# Altium schematic sheet SChema 2.SchDoc
size A
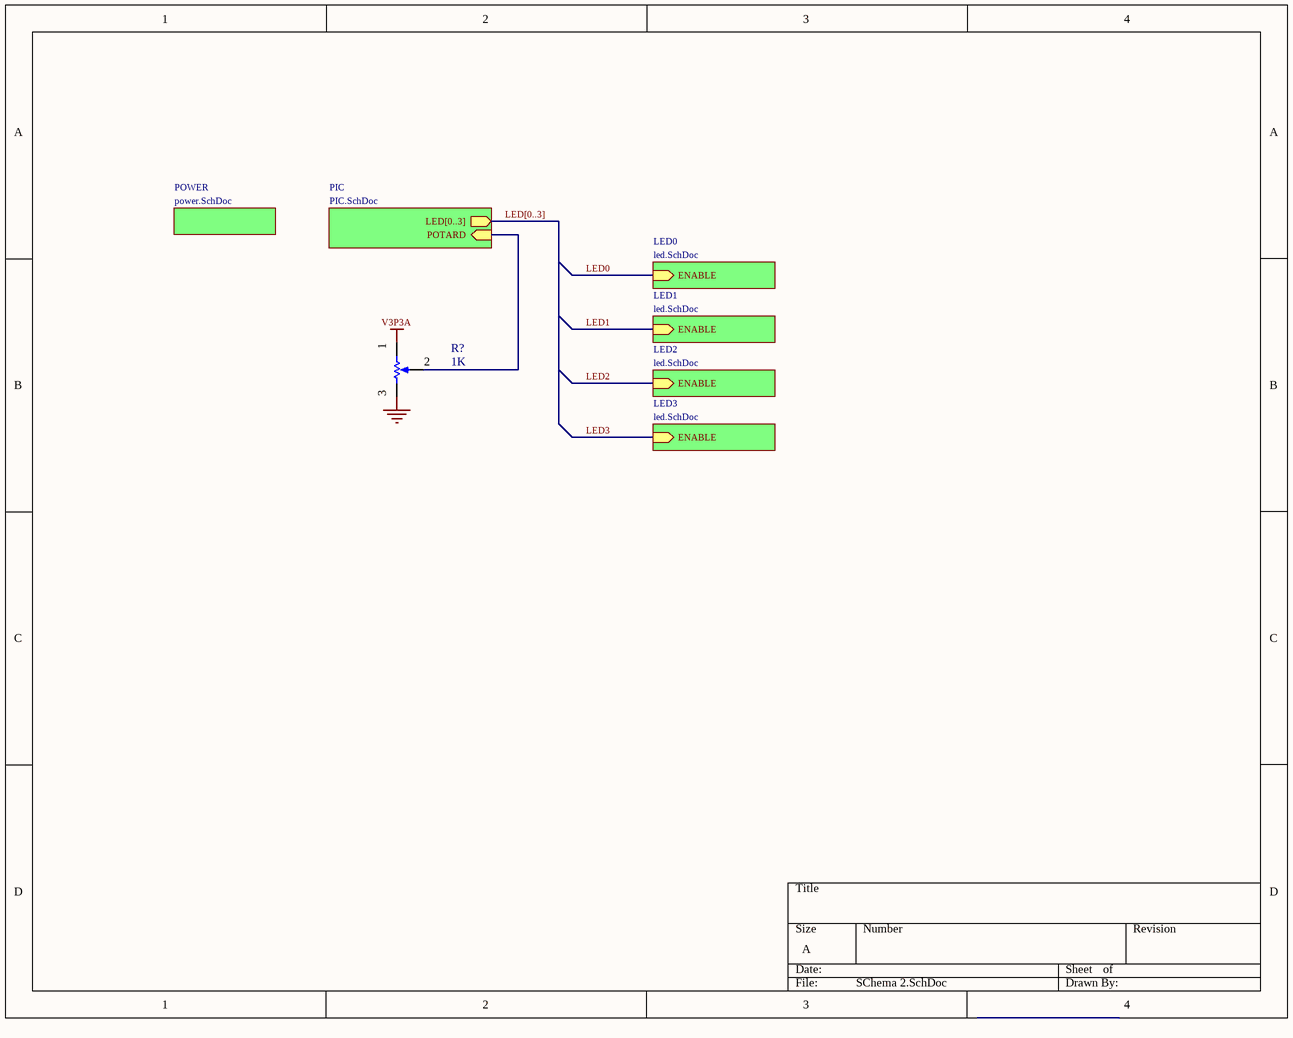
[diagram p0: SChema 2.SchDoc]

## Parts
R?  1K  [VR5]

## Sub-sheets
LED0 = led.SchDoc: ENABLE (in)
LED1 = led.SchDoc: ENABLE (in)
LED2 = led.SchDoc: ENABLE (in)
LED3 = led.SchDoc: ENABLE (in)
PIC = PIC.SchDoc: LED[0..3] (out), POTARD (in)
POWER = power.SchDoc: no entries

## Nets
GND: R?.1(TOP)
V3P3A: R?.2(BOT)
2: R?.3(TAP) ; sheet PIC/POTARD
LED0: sheet LED0/ENABLE
LED1: sheet LED1/ENABLE
LED2: sheet LED2/ENABLE
LED3: sheet LED3/ENABLE

## Buses and harness runs
bus LED[0..3] = sheet PIC/LED[0..3]

## Notes on the sheet
- Labels drawn without touching a wire or pin: 1, 3

## Library data of the parts
R? = RPot: Potentiometer; Sim Note: Enter the Resistance value and the set point into parameter fields.; Set Position: 0.5; Published: 8-Jun-2000; LatestRevisionDate: 17-Jul-2002; LatestRevisionNote: Re-released for DXP Platform.; PackageReference: VR5; Publisher: Altium Limited; PackageDescription: Variable Resistor, Thru-Hole; 3 Leads; Value: 1K